# Altium schematic sheet yard-ice-power.SchDoc: Yard-Ice-Power
size 365 x 274 mm; Revision: 1.0; SheetNumber: 2; SheetTotal: 5
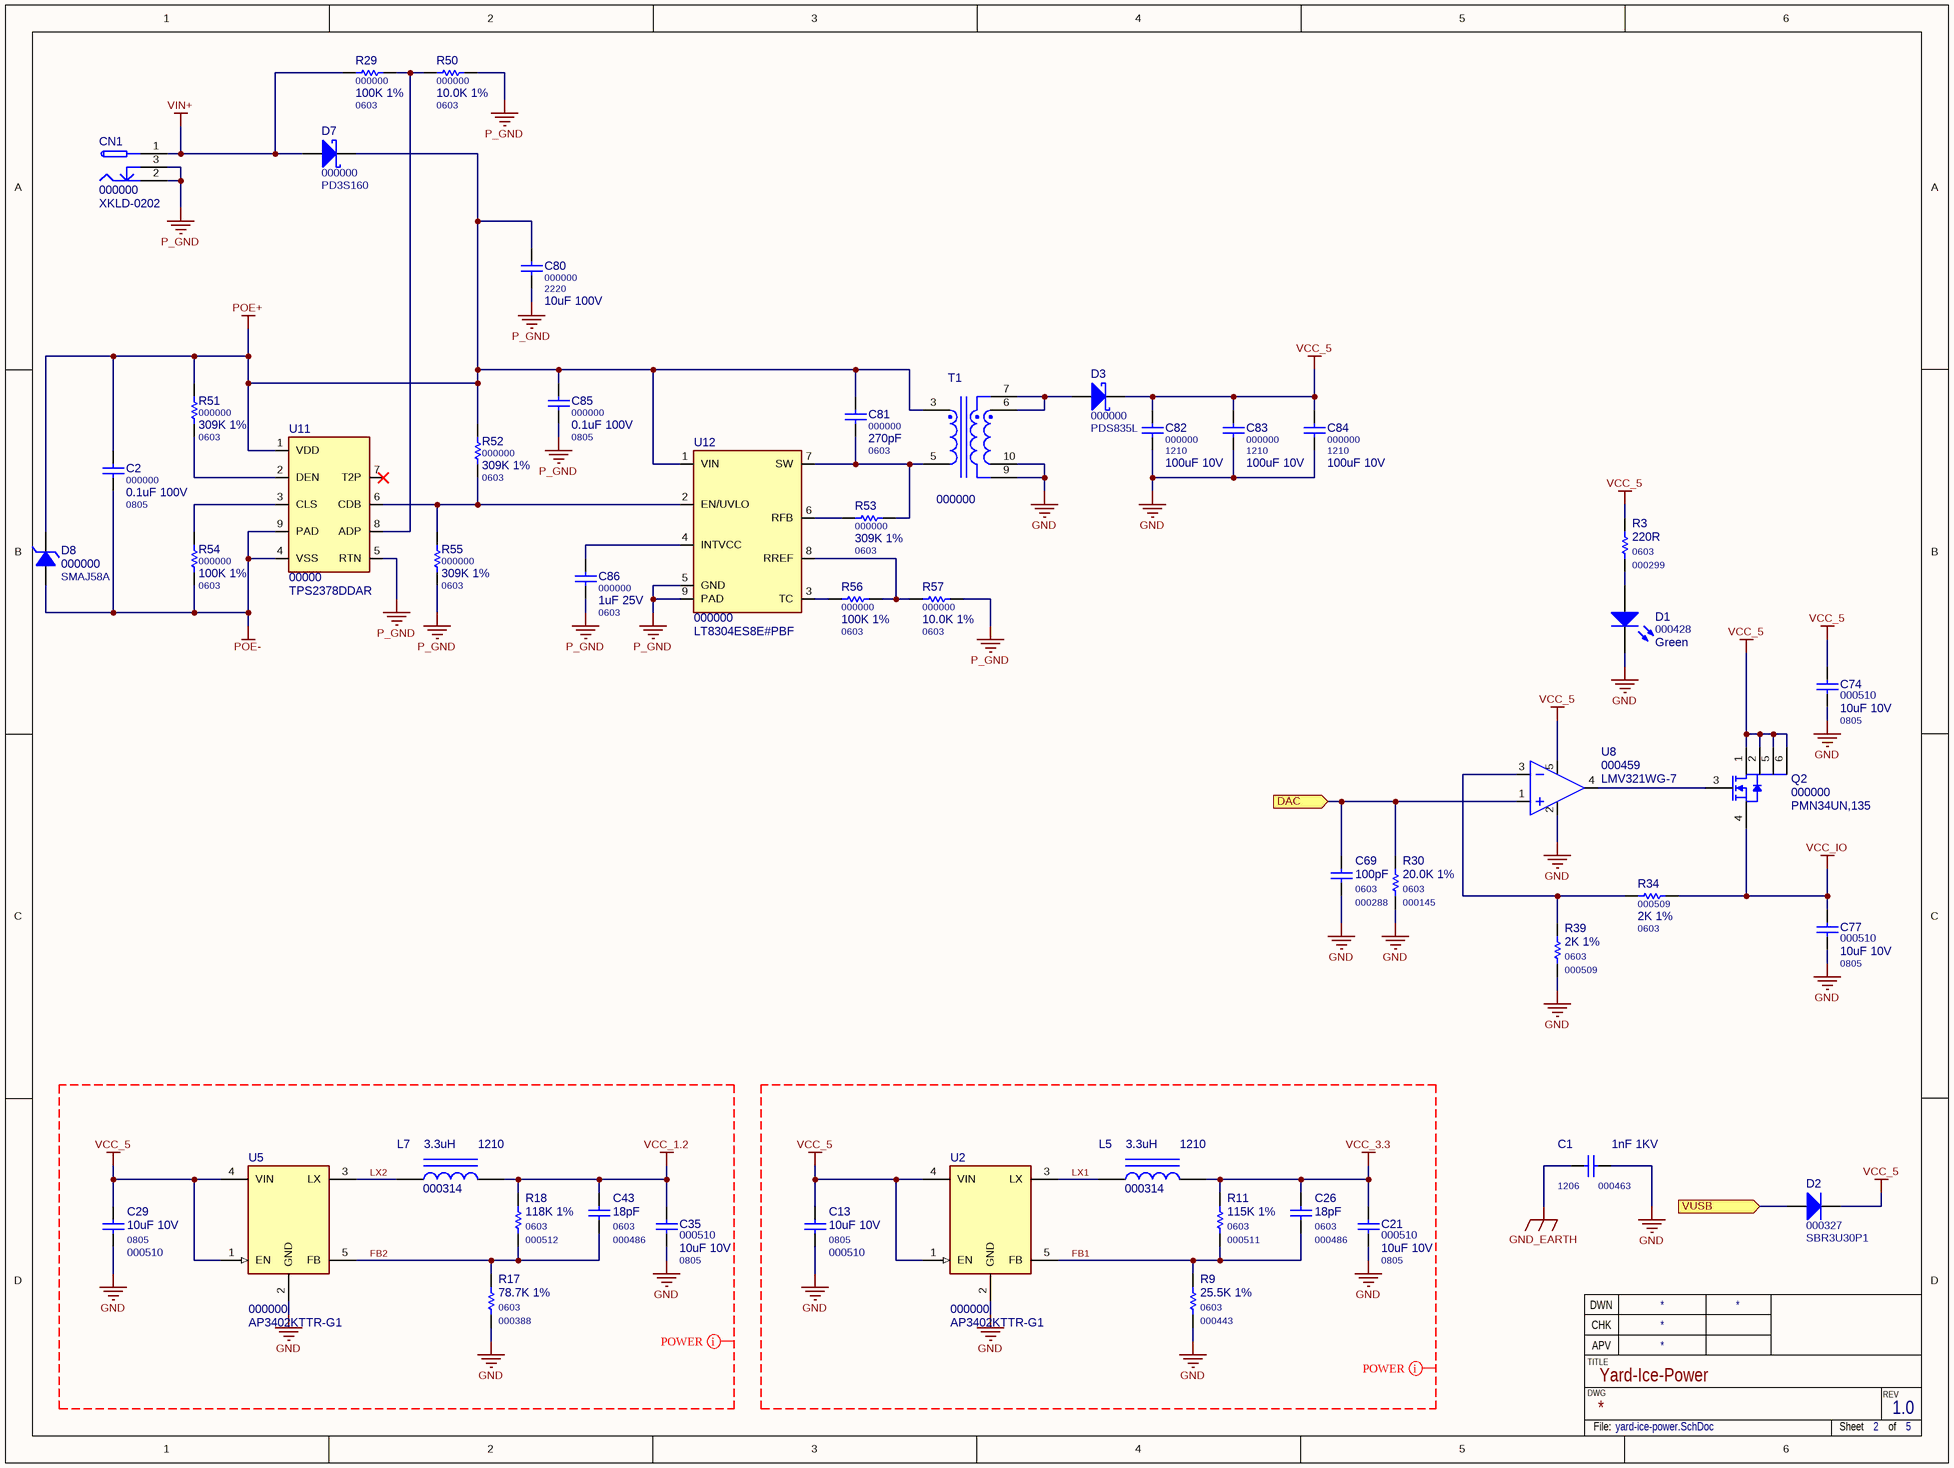
[diagram p0: yard-ice-power.SchDoc]

## Parts
C1  000463  value 1nF 1KV  Package: 1206  [C1206M]
C2  000000  value 0.1uF 100V  Package: 0805  [C0805HV]
C13  000510  value 10uF 10V  Package: 0805  [C0805M]
C21  000510  value 10uF 10V  Package: 0805  [C0805M]
C26  000486  value 18pF  Package: 0603  [C0603M]
C29  000510  value 10uF 10V  Package: 0805  [C0805M]
C35  000510  value 10uF 10V  Package: 0805  [C0805M]
C43  000486  value 18pF  Package: 0603  [C0603M]
C69  000288  value 100pF  Package: 0603  [C0603M]
C74  000510  value 10uF 10V  Package: 0805  [C0805M]
C77  000510  value 10uF 10V  Package: 0805  [C0805M]
C80  000000  value 10uF 100V  Package: 2220  [C2220M]
C81  000000  value 270pF  Package: 0603  [C0603HV]
C82  000000  value 100uF 10V  Package: 1210  [C1210M]
C83  000000  value 100uF 10V  Package: 1210  [C1210M]
C84  000000  value 100uF 10V  Package: 1210  [C1210M]
C85  000000  value 0.1uF 100V  Package: 0805  [C0805HV]
C86  000000  value 1uF 25V  Package: 0603  [C0603M]
CN1  000000  value XKLD-0202  [KLDX-0202]
D1  000428  value Green  [LED0805L LP]
D2  000327  value SBR3U30P1  [PowerDI 123]
D3  000000  value PDS835L  [PowerDI 5]
D7  000000  value PD3S160  [PowerDI 123]
D8  000000  value SMAJ58A  [DO-214AC]
L5  000314  value 3.3uH  Package: 1210  [L1210M]
L7  000314  value 3.3uH  Package: 1210  [L1210M]
Q2  000000  value PMN34UN,135  [SOT-26]
R3  000299  value 220R  Package: 0603  [R0603M]
R9  000443  value 25.5K 1%  Package: 0603  [R0603M]
R11  000511  value 115K 1%  Package: 0603  [R0603M]
R17  000388  value 78.7K 1%  Package: 0603  [R0603M]
R18  000512  value 118K 1%  Package: 0603  [R0603M]
R29  000000  value 100K 1%  Package: 0603  [R0603M]
R30  000145  value 20.0K 1%  Package: 0603  [R0603M]
R34  000509  value 2K 1%  Package: 0603  [R0603M]
R39  000509  value 2K 1%  Package: 0603  [R0603M]
R50  000000  value 10.0K 1%  Package: 0603  [R0603M]
R51  000000  value 309K 1%  Package: 0603  [R0603HV]
R52  000000  value 309K 1%  Package: 0603  [R0603HV]
R53  000000  value 309K 1%  Package: 0603  [R0603HV]
R54  000000  value 100K 1%  Package: 0603  [R0603M]
R55  000000  value 309K 1%  Package: 0603  [R0603HV]
R56  000000  value 100K 1%  Package: 0603  [R0603M]
R57  000000  value 10.0K 1%  Package: 0603  [R0603M]
T1  000000  [75031583X]
U2  000000  value AP3402KTTR-G1  [SOT23-5-M]
U5  000000  value AP3402KTTR-G1  [SOT23-5-M]
U8  000459  value LMV321WG-7  [SOT-25]
U11  00000  value TPS2378DDAR  [DDA (R-PDSO-G8)]
U12  000000  value LT8304ES8E#PBF  [S8E]

## Ports
DAC (in), VUSB (in)

## Nets
GND: C1.2 C13.2 C21.2 C29.2 C35.2 C69.2 C74.2 C77.2 C82.2 C83.2 C84.2 D1.2(K) R9.1 R17.1 R30.1 R39.1 T1.9 T1.10 U2.2(GND) U5.2(GND) U8.2(V-)
GND_EARTH: C1.1
P_GND: C80.2 C85.2 C86.2 CN1.2 CN1.3 R50.1 R55.2 R57.1 U11.5(RTN) U12.5(GND) U12.9(PAD)
POE+: C2.1 C80.1 C81.1 C85.1 D7.2(K) D8.2(K) R51.1 R52.1 T1.3 U11.1(VDD) U12.1(VIN)
POE-: C2.2 D8.1(A) R54.2 U11.4(VSS) U11.9(PAD)
VCC_1.2: C35.1 C43.1 L7.2 R18.2
VCC_3.3: C21.1 C26.1 L5.2 R11.2
VCC_5: C13.1 C29.1 C74.1 C82.1 C83.1 C84.1 D2.2(K) D3.2(K) Q2.1(D) Q2.2(D) Q2.5(D) Q2.6(D) R3.2 U2.1(EN) U2.4(VIN) U5.1(EN) U5.4(VIN) U8.5(V+)
VCC_IO: C77.1 Q2.4(S) R34.1
VIN+: CN1.1 D7.1(A) R29.2
DAC: C69.1 R30.2 U8.1(IN+) ; port DAC
FB1: C26.2 R9.2 R11.1 U2.5(FB)
FB2: C43.2 R17.2 R18.1 U5.5(FB)
LX1: L5.1 U2.3(LX)
LX2: L7.1 U5.3(LX)
VUSB: D2.1(A) ; port VUSB
NetC81_2: C81.2 R53.1 T1.5 U12.7(SW)
NetC86_1: C86.1 U12.4(INTVCC)
NetD1_1: D1.1(A) R3.1
NetD3_1: D3.1(A) T1.6 T1.7
NetQ2_3: Q2.3(G) U8.4(OUT)
NetR29_1: R29.1 R50.2 U11.8(ADP)
NetR34_2: R34.2 R39.2 U8.3(IN-)
NetR51_2: R51.2 U11.2(DEN)
NetR52_2: R52.2 R55.1 U11.6(CDB) U12.2(EN/UVLO)
NetR53_2: R53.2 U12.6(RFB)
NetR54_1: R54.1 U11.3(CLS)
NetR56_1: R56.1 R57.2 U12.8(RREF)
NetR56_2: R56.2 U12.3(TC)

Not connected (* = marked no-connect by the designer): U11 7(T2P)*

## Layout directives
net class POWER: FB1, FB2, GND, LX1, LX2, VCC_1.2, VCC_3.3, VCC_5

## Notes on the sheet
- TITLE
- CHK
- DWN
- APV
- DWG
- REV
- File:
- Sheet
- of

## Library data of the parts
C1 = C1206: SMD Ceramic Chip Capacitor - 1206; PN: 000463
C2 = C0805: SMD Ceramic Chip Capacitor - 0805; PN: 000000; ExtraInfo: *
C13 C21 C29 C35 = C0805: SMD Ceramic Chip Capacitor - 0805 - X7R; MF PN: C2012X7R1A106K; MF: TDK; PN: 000510
C26 C43 C69 C81 C86 = C0603: SMD Ceramic Chip Capacitor - 0603
  C26 C43: PN: 000486
  C69: PN: 000288
  C81 C86: PN: 000000; ExtraInfo: *
C74 C77 = C0805: SMD Ceramic Chip Capacitor - 0805 - X7R; MF PN: C2012X7R1A106K; PN: TDK; PN: 000510; MF: TDK
C80 = C2220: SMD Ceramic Chip Capacitor - 2220; MF: AVX; MF PN: 22201C106MAT2A; PN: 000000; ExtraInfo: *
C82-C84 = C1210: SMD Ceramic Chip Capacitor - 1210; ExtraInfo: 6XS; MF: Taiyo Yuden; MF PN: LMK325AC6107MM-P; PN: 000000; Price: 1.08452
C85 = C0805: SMD Ceramic Chip Capacitor - 0805; MF PN: GCM21BR72A104KA37K; PN: 000000; ExtraInfo: *
CN1 = XKLD-0202: Low Voltage Power Supply Connector; MF: KYCON; PN: 000000; ExtraInfo: *; Package: PTH; MF PN: XKLD-0202; Price: *; Digi-Key PN: *
D1 = LED0805LP: LED SMD 0805; Package: 0805; PN: 000428
D2 = SBR3U30P1: Super Barrier Rectifier; MF: Diodes Inc; PN: 000327; Package: PowerDI 123
D3 = PDS835L: Shottky Barrier Rectifier 25V 8A; MF PN: PDS835L-13; MF: Diodes Inc; PN: 000000; Package: PowerDI 5; ExtraInfo: *; Digi-Key PN: PDS835LDICT-ND; Price: 0.80369
D7 = PD3S160: Sshottky Barrier Rectifier 60V 1A; MF: Diodes Inc; PN: 000000; Package: PowerDI 123; ExtraInfo: *
D8 = SMAJXXA: Unidirectional Transiet Voltage Suppressor; MF: Bourns; PN: 000000; Package: SMA; ExtraInfo: *; MF PN: *
L5 L7 = L1210: SMD Wire Wound Inductor -  1210 (3225 metric); MF: Murata; MF PN: LQH32PN3R3NN0L; PN: 000314
Q2 = PMN34UN,135: N-Channel MOSFET 30V 4.9A 6TSOP; PN: 000000; Package: SOT23-6; ExtraInfo: *
R3 R9 R11 R17 R18 R29 R30 R34 R39 R50-R57 = R0603: SMD Chip Resistor - 0603
  R3: PN: 000299
  R9: PN: 000443
  R11: PN: 000511
  R17: PN: 000388
  R18: PN: 000512
  R29 R50-R57: PN: 000000; ExtraInfo: *
  R30: PN: 000145
  R34 R39: PN: 000509
T1 = 750315126: SMD Transformer; Value: 750315125; MF: Wurth; PN: 000000; ExtraInfo: *; Digi-Key PN: 1297-1195-1-ND; MF PN: 750315125; Price: 3.47870
U2 U5 = AP3429A: 2A Step-Down DC/DC Cnverter 1MHz Switching Frequency; MF: Diodes Inc; PN: 000000; Package: SOT-23-5; ExtraInfo: *; Digi-Key PN: AP3402KTTR-G1DICT-ND; MF PN: AP3402KTTR-G1; Price: 0.12375
U8 = LMV321WG-7: General Purpose, Low Voltage, Rail-to-Rail Output Operational Amplifier; MF: Diodes Inc; Package: SOT25; PN: 000459
U11 = TPS2378: PoE High-Power PD Interface; MF: Texas Instruments; PN: 00000; Package: 8-HSOP; ExtraInfo: *; MF PN: TPS2378DDAR
U12 = LT3804: 100V Isolated Flyback Converter; MF: Linear Technology; PN: 000000; Package: 8-SOIC-EP; ExtraInfo: *; MF PN: LT8304ES8E#PBF; Digi-Key PN: LT8304ES8E#PBF-ND; Price: 6.42920